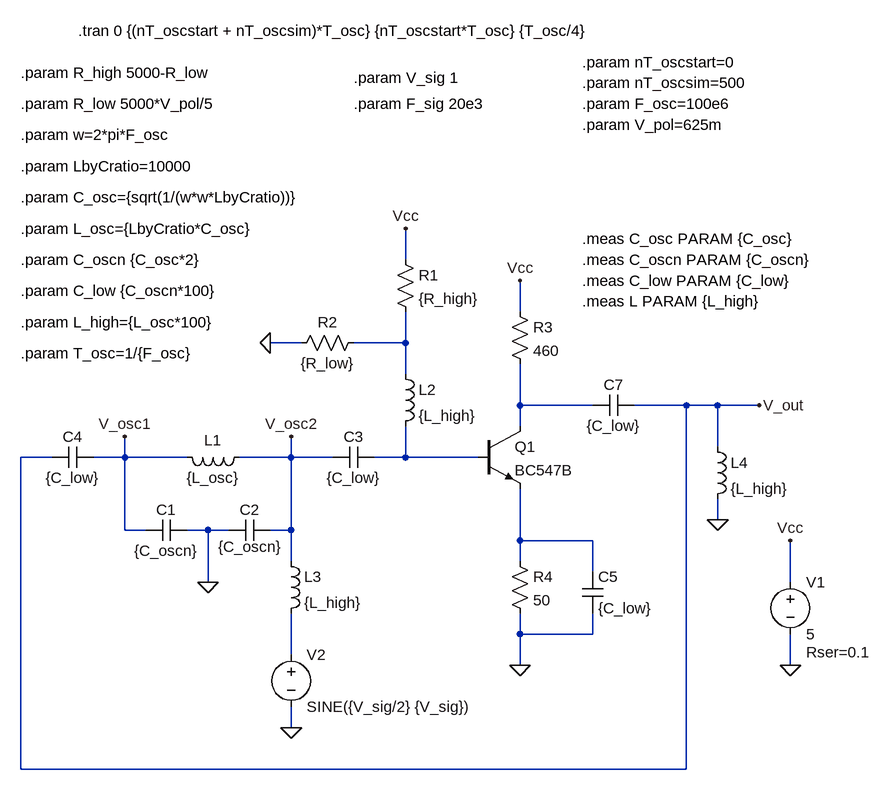
[diagram p0: schematic ColpittsVCO100MHz.asc]
ColpittsVCO100MHz.asc, the LTspice schematic file:
Version 4
SHEET 1 1688 680
WIRE 512 -224 512 -272
WIRE 688 -144 688 -192
WIRE 352 -96 304 -96
WIRE 512 -96 512 -144
WIRE 512 -96 432 -96
WIRE 512 -48 512 -96
WIRE 688 0 688 -64
WIRE 800 0 688 0
WIRE 944 0 864 0
WIRE 992 0 944 0
WIRE 1056 0 992 0
WIRE 688 32 688 0
WIRE 992 64 992 0
WIRE -32 80 -80 80
WIRE 80 80 80 48
WIRE 80 80 32 80
WIRE 176 80 80 80
WIRE 336 80 336 48
WIRE 336 80 256 80
WIRE 400 80 336 80
WIRE 512 80 512 32
WIRE 512 80 464 80
WIRE 624 80 512 80
WIRE 992 176 992 144
WIRE 80 192 80 80
WIRE 112 192 80 192
WIRE 208 192 176 192
WIRE 240 192 208 192
WIRE 336 192 336 80
WIRE 336 192 304 192
WIRE 688 208 688 128
WIRE 800 208 688 208
WIRE 336 240 336 192
WIRE 688 240 688 208
WIRE 800 256 800 208
WIRE 208 272 208 192
WIRE 1104 272 1104 208
WIRE 688 352 688 320
WIRE 800 352 800 320
WIRE 800 352 688 352
WIRE 336 384 336 320
WIRE 688 400 688 352
WIRE 1104 400 1104 352
WIRE 336 496 336 464
WIRE -80 560 -80 80
WIRE 944 560 944 0
WIRE 944 560 -80 560
FLAG 304 -96 0
FLAG 688 400 0
FLAG 688 -192 Vcc
FLAG 512 -272 Vcc
FLAG 1104 208 Vcc
FLAG 1104 400 0
FLAG 208 272 0
FLAG 1056 0 V_out
FLAG 80 48 V_osc1
FLAG 336 48 V_osc2
FLAG 336 496 0
FLAG 992 176 0
SYMBOL cap 176 176 R90
WINDOW 0 0 32 VBottom 2
WINDOW 3 32 32 VTop 2
SYMATTR InstName C1
SYMATTR Value {C_oscn}
SYMBOL cap 304 176 R90
WINDOW 0 0 32 VBottom 2
WINDOW 3 57 31 VBottom 2
SYMATTR InstName C2
SYMATTR Value {C_oscn}
SYMBOL ind 272 64 R90
WINDOW 0 5 56 VBottom 2
WINDOW 3 32 56 VTop 2
SYMATTR InstName L1
SYMATTR Value {L_osc}
SYMBOL cap 464 64 R90
WINDOW 0 0 32 VBottom 2
WINDOW 3 32 32 VTop 2
SYMATTR InstName C3
SYMATTR Value {C_low}
SYMBOL cap 32 64 R90
WINDOW 0 0 32 VBottom 2
WINDOW 3 32 32 VTop 2
SYMATTR InstName C4
SYMATTR Value {C_low}
SYMBOL npn 624 32 R0
SYMATTR InstName Q1
SYMATTR Value BC547B
SYMBOL res 496 -240 R0
SYMATTR InstName R1
SYMATTR Value {R_high}
SYMBOL res 448 -112 R90
WINDOW 0 0 56 VBottom 2
WINDOW 3 32 56 VTop 2
SYMATTR InstName R2
SYMATTR Value {R_low}
SYMBOL res 672 -160 R0
SYMATTR InstName R3
SYMATTR Value 460
SYMBOL res 672 224 R0
SYMATTR InstName R4
SYMATTR Value 50
SYMBOL cap 784 256 R0
SYMATTR InstName C5
SYMATTR Value {C_low}
SYMBOL voltage 1104 256 R0
WINDOW 123 0 0 Left 0
WINDOW 39 24 124 Left 2
SYMATTR SpiceLine Rser=0.1
SYMATTR InstName V1
SYMATTR Value 5
SYMBOL ind 320 224 R0
SYMATTR InstName L3
SYMATTR Value {L_high}
SYMBOL cap 864 -16 R90
WINDOW 0 0 32 VBottom 2
WINDOW 3 32 32 VTop 2
SYMATTR InstName C7
SYMATTR Value {C_low}
SYMBOL ind 496 -64 R0
SYMATTR InstName L2
SYMATTR Value {L_high}
SYMBOL voltage 336 368 R0
WINDOW 123 0 0 Left 0
WINDOW 39 0 0 Left 0
SYMATTR InstName V2
SYMATTR Value SINE({V_sig/2} {V_sig})
SYMBOL ind 976 48 R0
SYMATTR InstName L4
SYMATTR Value {L_high}
TEXT 8 -576 Left 2 !.tran 0 {(nT_oscstart + nT_oscsim)*T_osc} {nT_oscstart*T_osc} {T_osc/4}
TEXT -80 -320 Left 2 !.param C_osc={sqrt(1/(w*w*LbyCratio))}
TEXT -80 -176 Left 2 !.param C_low {C_oscn*100}
TEXT 784 -464 Left 2 !.param F_osc=100e6
TEXT -80 -224 Left 2 !.param C_oscn {C_osc*2}
TEXT -80 -512 Left 2 !.param R_high 5000-R_low
TEXT 784 -432 Left 2 !.param V_pol=625m
TEXT -80 -464 Left 2 !.param R_low 5000*V_pol/5
TEXT -80 -272 Left 2 !.param L_osc={LbyCratio*C_osc}
TEXT -80 -416 Left 2 !.param w=2*pi*F_osc
TEXT -80 -80 Left 2 !.param T_osc=1/{F_osc}
TEXT -80 -368 Left 2 !.param LbyCratio=10000
TEXT 784 -256 Left 2 !.meas C_osc PARAM {C_osc}
TEXT 784 -224 Left 2 !.meas C_oscn PARAM {C_oscn}
TEXT 784 -160 Left 2 !.meas L PARAM {L_high}
TEXT 784 -192 Left 2 !.meas C_low PARAM {C_low}
TEXT 784 -496 Left 2 !.param nT_oscsim=500
TEXT 784 -528 Left 2 !.param nT_oscstart=0
TEXT -80 -128 Left 2 !.param L_high={L_osc*100}
TEXT 432 -504 Left 2 !.param V_sig 1
TEXT 432 -464 Left 2 !.param F_sig 20e3

The netlist it stands for:
* ColpittsVCO100MHz.asc
C1 0 V_osc1 {C_oscn}
C2 V_osc2 0 {C_oscn}
L1 V_osc2 V_osc1 {L_osc}
C3 N003 V_osc2 {C_low}
C4 V_osc1 V_out {C_low}
Q1 N002 N003 N004 0 BC547B
R1 Vcc N001 {R_high}
R2 N001 0 {R_low}
R3 Vcc N002 460
R4 N004 0 50
C5 N004 0 {C_low}
V1 Vcc 0 5 Rser=0.1
L3 V_osc2 N005 {L_high}
C7 V_out N002 {C_low}
L2 N001 N003 {L_high}
V2 N005 0 SINE({V_sig/2} {V_sig})
L4 V_out 0 {L_high}
.model NPN NPN
.model PNP PNP
.lib standard.bjt
.tran 0 {(nT_oscstart + nT_oscsim)*T_osc} {nT_oscstart*T_osc} {T_osc/4}
.param C_osc={sqrt(1/(w*w*LbyCratio))}
.param C_low {C_oscn*100}
.param F_osc=100e6
.param C_oscn {C_osc*2}
.param R_high 5000-R_low
.param V_pol=625m
.param R_low 5000*V_pol/5
.param L_osc={LbyCratio*C_osc}
.param w=2*pi*F_osc
.param T_osc=1/{F_osc}
.param LbyCratio=10000
.meas C_osc PARAM {C_osc}
.meas C_oscn PARAM {C_oscn}
.meas L PARAM {L_high}
.meas C_low PARAM {C_low}
.param nT_oscsim=500
.param nT_oscstart=0
.param L_high={L_osc*100}
.param V_sig 1
.param F_sig 20e3
.backanno
.end